# Altium project POVBase.PrjPcb
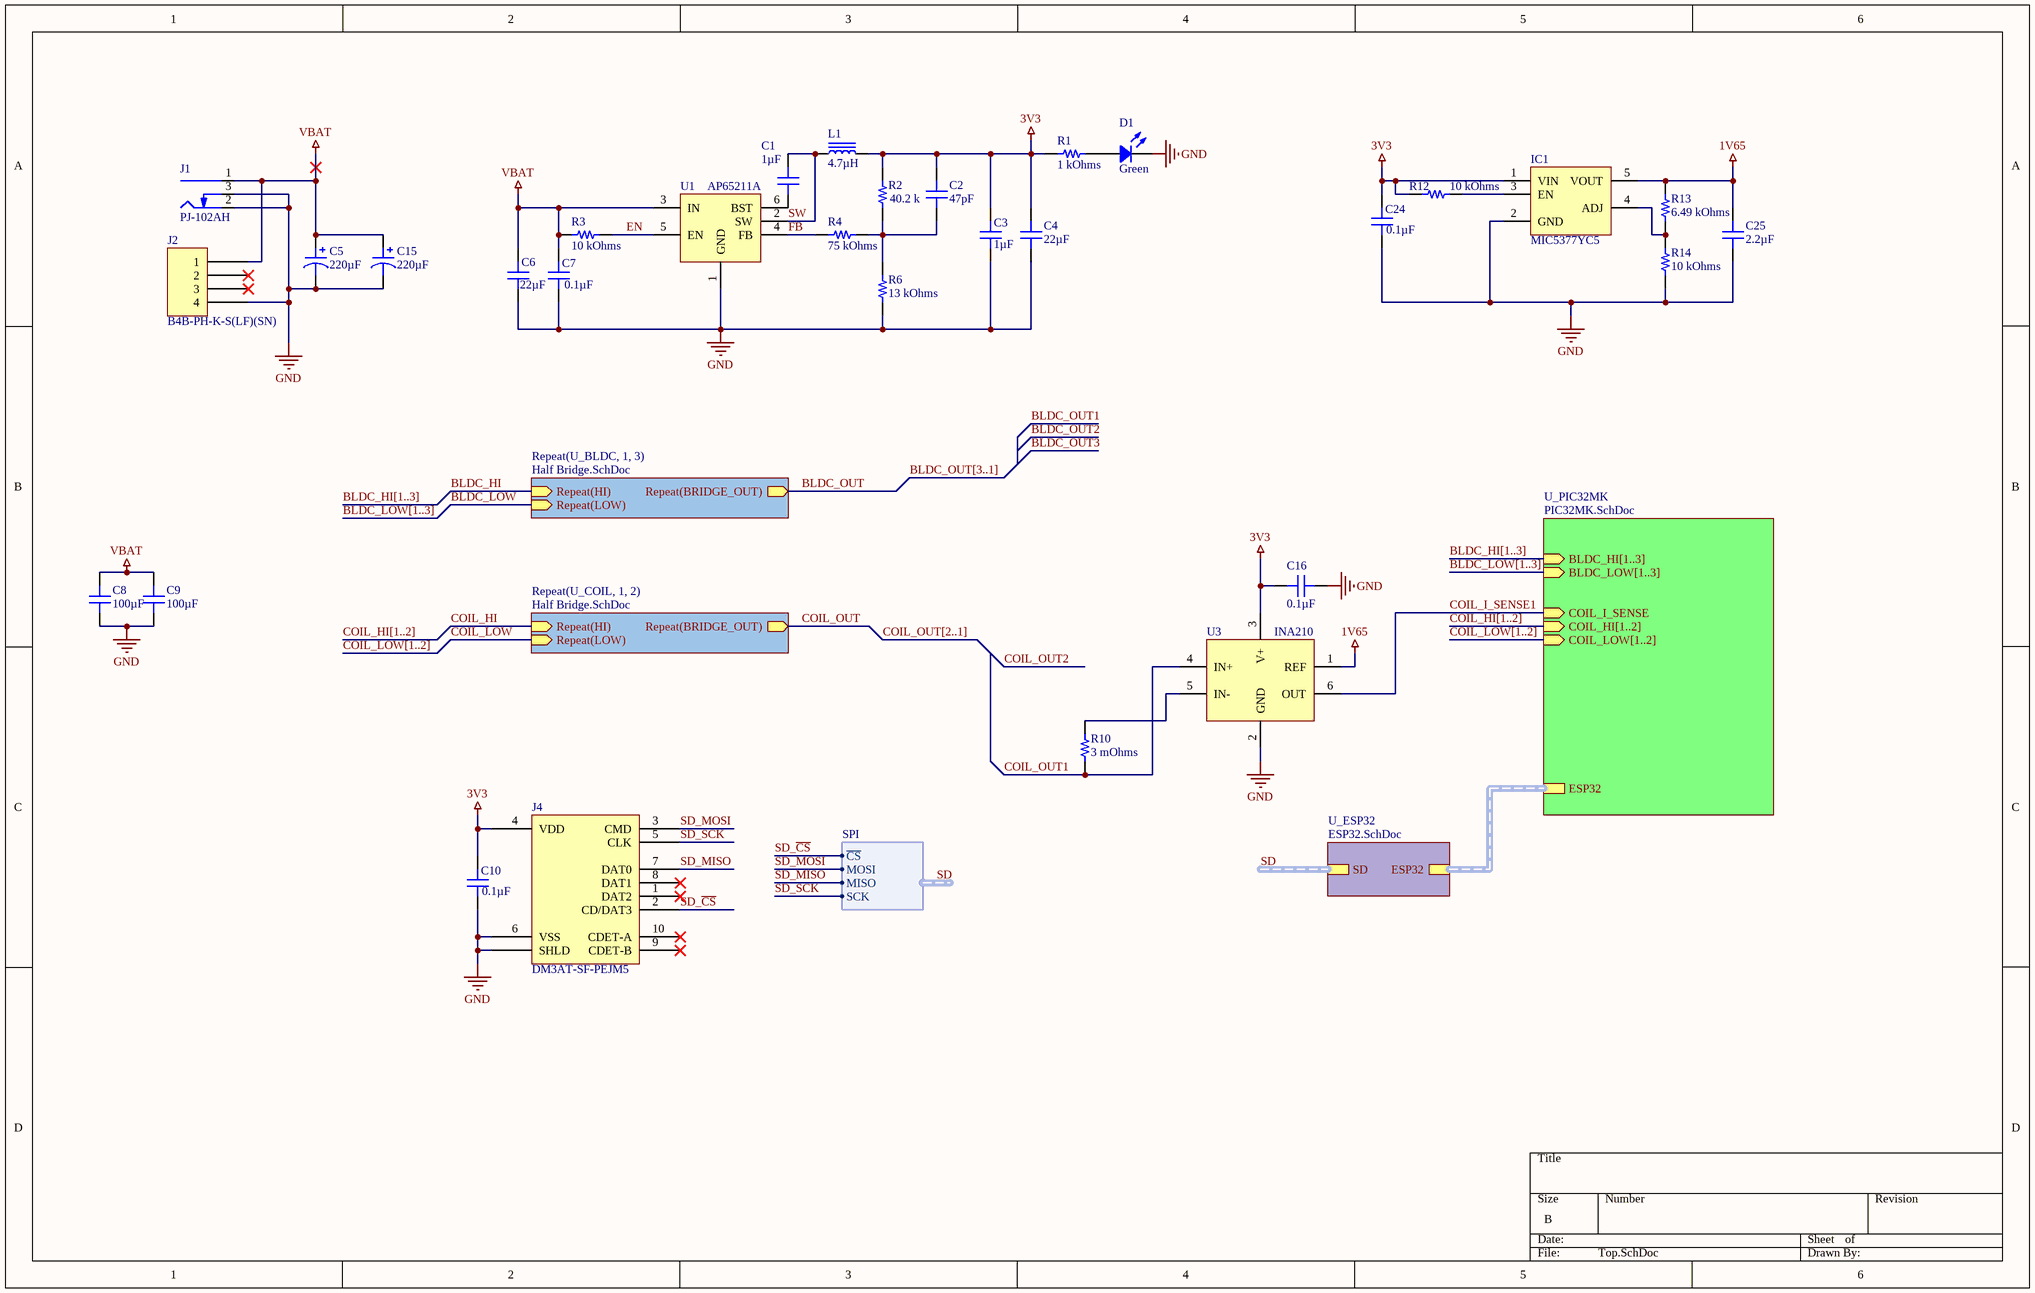
[diagram p0: Top.SchDoc]
4 sheets, 110 parts. Net scope: hierarchical (ports join the sheet entries above them; power ports are global).
Board file: POVBase.PcbDoc
Sheets:
  Top.SchDoc
    U_BLDC1 = Half Bridge.SchDoc
    U_BLDC2 = Half Bridge.SchDoc
    U_BLDC3 = Half Bridge.SchDoc
    U_PIC32MK = PIC32MK.SchDoc
    U_COIL1 = Half Bridge.SchDoc
    U_COIL2 = Half Bridge.SchDoc
    U_ESP32 = ESP32.SchDoc

## Sheet Top.SchDoc
size B

### Parts
C1  1µF  [CAP 0603_1608]
C2  47pF  [CAP 0603_1608]
C3  1µF  [CAP 0603_1608]
C4  22µF  [CAP 0805_2012]
C5  220µF  [CAP POL 2917_7343]
C6  22µF  [CAP 0805_2012]
C7  0.1µF  [CAP 0603_1608]
C8  100µF  [CAP 1210_3225 - 2.8MM]
C9  100µF  [CAP 1210_3225 - 2.8MM]
C10  0.1µF  [CAP 0603_1608]
C15  220µF  [CAP POL 2917_7343]
C16  0.1µF  [CAP 0603_1608]
C24  0.1µF  [CAP 0603_1608]
C25  2.2µF  [CAP 0603_1608]
D1  Green  [LED 0603_1608 GREEN]
IC1  MIC5377YC5  [TI SOT-23-5 DBV]
J1  PJ-102AH  [CUI PJ-102AH]
J2  B4B-PH-K-S(LF)(SN)  [JST B4B-PH-K]
J4  DM3AT-SF-PEJM5  [HIROSE DM3AT-SF-PEJM5]
L1  4.7µH  [IND 1008_2520]
R1  1 kOhms  [RES 0603_1608]
R2  40.2 k  [RES 0603_1608]
R3  10 kOhms  [RES 0603_1608]
R4  75 kOhms  [RES 0603_1608]
R6  13 kOhms  [RES 0603_1608]
R10  3 mOhms  [STACKPOLE CSR0805]
R12  10 kOhms  [RES 0603_1608]
R13  6.49 kOhms  [RES 0603_1608]
R14  10 kOhms  [RES 0603_1608]
U1  AP65211A  [TSOT-26-6]
U3  INA210  [TI SC70-6 DCK]

### Sub-sheets
Repeat(U_BLDC, 1, 3) = Half Bridge.SchDoc: Repeat(BRIDGE_OUT) (out), Repeat(HI) (in), Repeat(LOW) (in)
Repeat(U_COIL, 1, 2) = Half Bridge.SchDoc: Repeat(HI) (in), Repeat(LOW) (in), Repeat(BRIDGE_OUT) (out)
U_ESP32 = ESP32.SchDoc: ESP32 (harness ESP32), SD (harness SPI)
U_PIC32MK = PIC32MK.SchDoc: BLDC_HI[1..3] (in), BLDC_LOW[1..3] (in), COIL_I_SENSE (in), COIL_LOW[1..2] (in), COIL_HI[1..2] (in), ESP32 (harness ESP32)

### Harnesses
SPI: ~{CS}, MOSI, MISO, SCK

### Nets
1V65: C25.2 IC1.5(VOUT) R13.2 U3.1(REF)
3V3: C2.2 C3.2 C4.2 C10.1 C16.1 C24.1 IC1.1(VIN) J4.4(VDD) L1.2 R1.1 R2.2 R12.2 U3.3(V+)
GND: C3.1 C4.1 C5.2 C6.1 C7.2 C8.1 C9.1 C10.2 C15.2 C16.2 C24.2 C25.1 D1.2 IC1.2(GND) J1.2(Outer) J1.3(SW) J2.4 J4.6(VSS) J4.S(SHLD) R6.1 R14.1 U1.1(GND) U3.2(GND)
VBAT: C5.1 C6.2 C7.1 C8.2 C9.2 C15.1 J1.1(Centre) J2.1 R3.2 U1.3(IN)
BLDC_HI: sheet Repeat(U_BLDC, 1, 3)/Repeat(HI)
BLDC_LOW: sheet Repeat(U_BLDC, 1, 3)/Repeat(LOW)
BLDC_OUT: sheet Repeat(U_BLDC, 1, 3)/Repeat(BRIDGE_OUT)
COIL_HI: sheet Repeat(U_COIL, 1, 2)/Repeat(HI)
COIL_I_SENSE1: U3.6(OUT) ; sheet U_PIC32MK/COIL_I_SENSE  [project net COIL_I_SENSE]
COIL_LOW: sheet Repeat(U_COIL, 1, 2)/Repeat(LOW)
COIL_OUT: sheet Repeat(U_COIL, 1, 2)/Repeat(BRIDGE_OUT)
COIL_OUT1: R10.1 U3.4(IN+)  [project net BRIDGE_OUT]
EN: R3.1 U1.5(EN)
FB: R4.1 U1.4(FB)
SD_~{CS}: J4.2(CD/DAT3) ; sheet U_ESP32/SD.~{CS}  [project net ESP_~{CS}]
SD_MISO: J4.7(DAT0) ; sheet U_ESP32/SD.MISO  [project net ESP_SDI]
SD_MOSI: J4.3(CMD) ; sheet U_ESP32/SD.MOSI  [project net ESP_SDO]
SD_SCK: J4.5(CLK) ; sheet U_ESP32/SD.SCK  [project net ESP_SCK]
SW: C1.1 L1.1 U1.2(SW)
NetC1_2: C1.2 U1.6(BST)
NetC2_1: C2.1 R2.1 R4.2 R6.2
NetD1_1: D1.1 R1.2
NetIC1_3: IC1.3(EN) R12.1
NetIC1_4: IC1.4(ADJ) R13.1 R14.2
NetR10_2: R10.2 U3.5(IN-)

Not connected (* = marked no-connect by the designer): J2 2* 3*; J4 1(DAT2)* 8(DAT1)* 9(CDET-B)* 10(CDET-A)*

### Buses and harness runs
bus BLDC_HI[1..3]
bus BLDC_HI[1..3] = sheet U_PIC32MK/BLDC_HI[1..3]
bus BLDC_LOW[1..3]
bus BLDC_LOW[1..3] = sheet U_PIC32MK/BLDC_LOW[1..3]
bus BLDC_OUT[3..1]
bus COIL_HI[1..2]
bus COIL_HI[1..2] = sheet U_PIC32MK/COIL_HI[1..2]
bus COIL_LOW[1..2]
bus COIL_LOW[1..2] = sheet U_PIC32MK/COIL_LOW[1..2]
bus COIL_OUT[2..1]
harness SD = sheet U_ESP32/SD
harness sheet U_ESP32/ESP32 = sheet U_PIC32MK/ESP32

### Library data of the parts
C1 C3 = GCJ188R71E105KA01D: CAP CER 1UF 25V X7R 0603; Manufacturer: Murata Electronics; Tolerance: ±10%; Part Number: GCJ188R71E105KA01D; Value: 1µF; Applications: Automotive, Boardflex Sensitive; Capacitance: 1µF; ComponentLink1Description: Datasheet; ComponentLink1URL: https://search.murata.co.jp/Ceramy/image/img/A01X/G101/ENG/GCJ188R71E105KA01-01.pdf; ComponentLink2Description: DigiKey Link; ComponentLink2URL: http://digikey.com/product-detail/en/murata-electronics/GCJ188R71E105KA01D/490-14409-1-ND/6606870; Device Package: 0603 (1608 Metric); Features: Soft Termination; LastUpdated: 13-Aug-20 10:24:06 AM; Lifecycle Status: Active; Minimum Order: 1; Mounting Type: Surface Mount, MLCC; Operating Temperature: -55°C ~ 125°C; Package / Case: 0603 (1608 Metric); Packaging: TapeAndReel; PartId: 9566; Part Status: Active; Price: 0.05; Ratings: AEC-Q200; Series: GCJ; Size / Dimension: 0.063" L x 0.031" W (1.60mm x 0.80mm); Supplier 1: DigiKey; Supplier Part Number 1: 490-14409-1-ND; Temperature Coefficient: X7R; Thickness (Max): 0.035" (0.90mm)
C2 = C1608NP02A470J080AA: CAP CER 47PF 100V NP0 0603; Manufacturer: TDK Corporation; Temperature Coefficient: C0G, NP0; Tolerance: ±5%; Part Number: C1608NP02A470J080AA; Value: 47pF; Applications: General Purpose; Capacitance: 47pF; ComponentLink1Description: Datasheet; ComponentLink1URL: https://product.tdk.com/info/en/catalog/datasheets/mlcc_commercial_hightemp_en.pdf?ref_disty=digikey; ComponentLink2Description: DigiKey Link; ComponentLink2URL: http://digikey.com/product-detail/en/tdk-corporation/C1608NP02A470J080AA/445-14125-1-ND/3955791; Device Package: 0603 (1608 Metric); Features: High Temperature; LastUpdated: 13-Aug-20 10:25:18 AM; Lifecycle Status: Active; Minimum Order: 1; Mounting Type: Surface Mount, MLCC; Operating Temperature: -55°C ~ 150°C; Package / Case: 0603 (1608 Metric); Packaging: TapeAndReel; PartId: 7049; Part Status: Active; Price: 0.04; Series: C; Size / Dimension: 0.063" L x 0.031" W (1.60mm x 0.80mm); Supplier 1: DigiKey; Supplier Part Number 1: 445-14125-1-ND; Thickness (Max): 0.035" (0.90mm)
C4 = CL21A226MOQNNNE: CAP CER 22UF 16V X5R 0805; Manufacturer: Samsung Electro-Mechanics; Tolerance: ±20%; Part Number: CL21A226MOQNNNE; Value: 22µF; Applications: General Purpose; Capacitance: 22µF; ComponentLink1Description: Datasheet; ComponentLink1URL: http://www.samsungsem.com/kr/support/product-search/mlcc/CL21A226MOQNNNE.jsp; ComponentLink2Description: DigiKey Link; ComponentLink2URL: http://digikey.com/product-detail/en/samsung-electro-mechanics/CL21A226MOQNNNE/1276-2909-1-ND/3890995; Device Package: 0805 (2012 Metric); LastUpdated: 21-Jan-20 12:03:05 AM; Lifecycle Status: Active; Minimum Order: 1; Mounting Type: Surface Mount, MLCC; Operating Temperature: -55°C ~ 85°C; Package / Case: 0805 (2012 Metric); Packaging: TapeAndReel; PartId: 3052; Part Status: Active; Price: 0.11; Series: CL; Size / Dimension: 0.079" L x 0.049" W (2.00mm x 1.25mm); Supplier 1: DigiKey; Supplier Part Number 1: 1276-2909-1-ND; Temperature Coefficient: X5R; Thickness (Max): 0.055" (1.40mm); Voltage - Rated: 16V
C5 C15 = T510X227K016ATE040: CAP TANT 220UF 10% 16V 2917; Manufacturer: KEMET; Manufacturer Size Code: X; ESR (Equivalent Series Resistance): 40mOhm; Lifetime @ Temp.: 2000 Hrs @ 85°C; Type: Molded; Part Number: T510X227K016ATE040; Value: 220µF; Capacitance: 220µF; ComponentLink1Description: Datasheet; ComponentLink1URL: https://api.kemet.com/component-edge/download/datasheet/T510X227K016ATE040.pdf; ComponentLink2Description: DigiKey Link; ComponentLink2URL: http://digikey.com/product-detail/en/kemet/T510X227K016ATE040/399-4805-1-ND/1085524; Device Package: 2917 (7343 Metric); Features: General Purpose; Height - Seated (Max): 0.169" (4.30mm); LastUpdated: 30-Aug-20 8:55:47 PM; Lifecycle Status: Active; Minimum Order: 1; Mounting Type: Surface Mount; Operating Temperature: -55°C ~ 125°C; Package / Case: 2917 (7343 Metric); Packaging: TapeAndReel; PartId: 1966; Part Status: Active; Price: 4.46; Series: T510; Size / Dimension: 0.287" L x 0.169" W (7.30mm x 4.30mm); Supplier 1: DigiKey; Supplier Part Number 1: 399-4805-1-ND; Tolerance: ±10%; Voltage - Rated: 16V
C6 = C2012X7S1E106K125AC: CAP CER 10UF 25V X7S 0805; Manufacturer: TDK Corporation; Capacitance: 10µF; Tolerance: ±10%; Part Number: C2012X7S1E106K125AC; Value: 22µF; Applications: General Purpose; ComponentLink1Description: Datasheet; ComponentLink1URL: https://product.tdk.com/en/search/capacitor/ceramic/mlcc/info?part_no=C2012X7S1E106K125AC?ref_disty=digikey; ComponentLink2Description: DigiKey Link; ComponentLink2URL: http://digikey.com/product-detail/en/tdk-corporation/C2012X7S1E106K125AC/445-181600-1-ND/9991478; Device Package: 0805 (2012 Metric); Features: Low ESL; LastUpdated: 21-Jan-20 12:03:04 AM; Lifecycle Status: Active; Minimum Order: 1; Mounting Type: Surface Mount, MLCC; Operating Temperature: -55°C ~ 125°C; Package / Case: 0805 (2012 Metric); Packaging: TapeAndReel; PartId: 3339; Part Status: Active; Price: 0.15; Series: C; Size / Dimension: 0.079" L x 0.049" W (2.00mm x 1.25mm); Supplier 1: DigiKey; Supplier Part Number 1: 445-181600-1-ND; Temperature Coefficient: X7S; Thickness (Max): 0.057" (1.45mm); Voltage - Rated: 25V
C7 C10 C16 C24 = GCG188R92A104KA03D: CAP CER 0.1UF 100V 0603 EPOXY; Manufacturer: Murata Electronics; Temperature Coefficient: X8R; Tolerance: ±10%; Part Number: GCG188R92A104KA03D; Value: 0.1µF; Applications: Automotive; Capacitance: 0.1µF; ComponentLink1Description: Datasheet; ComponentLink1URL: https://search.murata.co.jp/Ceramy/image/img/A01X/G101/ENG/GCG188R92A104KA03-01.pdf; ComponentLink2Description: DigiKey Link; ComponentLink2URL: http://digikey.com/product-detail/en/murata-electronics/GCG188R92A104KA03D/490-18197-1-ND/9867926; Device Package: 0603 (1608 Metric); Features: Epoxy Mountable; LastUpdated: 21-Jan-20 12:01:59 AM; Lifecycle Status: Active; Minimum Order: 1; Mounting Type: Surface Mount, MLCC, Epoxy; Operating Temperature: -55°C ~ 150°C; Package / Case: 0603 (1608 Metric); Packaging: TapeAndReel; PartId: 9025; Part Status: Active; Price: 0.07; Ratings: AEC-Q200; Series: GCG; Size / Dimension: 0.063" L x 0.031" W (1.60mm x 0.80mm); Supplier 1: DigiKey; Supplier Part Number 1: 490-18197-1-ND; Thickness (Max): 0.035" (0.90mm); Voltage - Rated: 100V
C8 C9 = EMK325ABJ107MM-P: CAP CER 100UF 16V X5R 1210; Manufacturer: Taiyo Yuden; Tolerance: ±20%; Part Number: EMK325ABJ107MM-P; Value: 100µF; Applications: General Purpose; Capacitance: 100µF; ComponentLink1Description: Datasheet; ComponentLink1URL: https://ds.yuden.co.jp/TYCOMPAS/ut/detail?pn=EMK325ABJ107MM-P &u=M; ComponentLink2Description: DigiKey Link; ComponentLink2URL: http://digikey.com/product-detail/en/taiyo-yuden/EMK325ABJ107MM-P/587-5426-1-ND/7067102; Device Package: 1210 (3225 Metric); LastUpdated: 21-Jan-20 12:30:21 AM; Lifecycle Status: Active; Minimum Order: 1; Mounting Type: Surface Mount, MLCC; Operating Temperature: -55°C ~ 85°C; Package / Case: 1210 (3225 Metric); Packaging: TapeAndReel; PartId: 24141; Part Status: Active; Price: 0.71; Series: M; Size / Dimension: 0.126" L x 0.098" W (3.20mm x 2.50mm); Supplier 1: DigiKey; Supplier Part Number 1: 587-5426-1-ND; Temperature Coefficient: X5R; Thickness (Max): 0.110" (2.80mm); Voltage - Rated: 16V
C25 = CC0603ZRY5V5BB225: CAP CER 2.2UF 6.3V Y5V 0603; Manufacturer: Yageo; Temperature Coefficient: Y5V (F); Tolerance: -20%, +80%; Part Number: CC0603ZRY5V5BB225; Value: 2.2µF; Applications: General Purpose; Capacitance: 2.2µF; ComponentLink1Description: Datasheet; ComponentLink1URL: http://www.yageo.com/documents/recent/UPY-GPHC_Y5V_6.3V-to-50V_8.pdf; ComponentLink2Description: DigiKey Link; ComponentLink2URL: http://digikey.com/product-detail/en/yageo/CC0603ZRY5V5BB225/311-1452-1-ND/2833758; Device Package: 0603 (1608 Metric); LastUpdated: 21-Jan-20 12:02:09 AM; Lifecycle Status: Active; Minimum Order: 1; Mounting Type: Surface Mount, MLCC; Operating Temperature: -30°C ~ 85°C; Package / Case: 0603 (1608 Metric); Packaging: TapeAndReel; PartId: 2250; Part Status: Active; Price: 0.02; Series: CC; Size / Dimension: 0.063" L x 0.031" W (1.60mm x 0.80mm); Supplier 1: DigiKey; Supplier Part Number 1: 311-1452-1-ND; Thickness (Max): 0.035" (0.90mm); Voltage - Rated: 6.3V
D1 = XZCDGK53W-8VF: 1.6X0.8MM LC GREEN PIXSOLED DOME; Manufacturer: SunLED; Configuration: Independent; Current - Test: 2mA; Lens Color: Colorless; Lens Size: 0.35mm Dia; Lens Style: Round with Domed Top; Lens Transparency: Clear; Millicandela Rating: 417mcd; Viewing Angle: 60°; Voltage - Forward (Vf) (Typ): 2.65V; Wavelength - Dominant: 525nm; Wavelength - Peak: 515nm; Part Number: XZCDGK53W-8VF; Color: Green; ComponentLink1Description: Datasheet; ComponentLink1URL: https://www.sunledusa.com/products/spec/XZCDGK53W-8VF.pdf; ComponentLink2Description: DigiKey Link; ComponentLink2URL: http://digikey.com/product-detail/en/sunled/XZCDGK53W-8VF/1497-XZCDGK53W-8VFCT-ND/10449792; Device Package: 0603 (1608 Metric); Height (Max): 1.10mm; LastUpdated: 21-Jan-20 3:12:09 AM; Lifecycle Status: Active; Minimum Order: 1; Mounting Type: Surface Mount; Package / Case: 0603 (1608 Metric); Packaging: Unknown; PartId: 938; Part Status: Active; Price: 0.18; Series: Ultra Low Current; Size / Dimension: 1.60mm L x 0.80mm W; Supplier 1: DigiKey; Supplier Part Number 1: 1497-XZCDGK53W-8VFCT-ND; Supplier Device Package: 2-SMD; Value: Green
IC1 = MIC5377YC5: IC REG LIN POS ADJ 150MA SOT23-5; Manufacturer: Texas Instruments; Control Features: Enable; Current - Quiescent (Iq): 100µA; Current - Supply (Max): 140µA; Number of Regulators: 1; Output Configuration: Positive; Output Type: Adjustable; Protection Features: Over Current, Over Temperature, Reverse Polarity; PSRR: 60dB (1kHz); Voltage - Input (Max): 10V; Voltage - Output (Max): 6.5V; Voltage - Output (Min/Fixed): 1.5V; Part Number: MIC5377YC5; ComponentLink1Description: Datasheet; ComponentLink1URL: http://www.ti.com/general/docs/suppproductinfo.tsp?distId=10&gotoUrl=http%3A%2F%2Fwww.ti.com%2Flit%2Fgpn%2Ftps763; ComponentLink2Description: DigiKey Link; ComponentLink2URL: http://digikey.com/product-detail/en/texas-instruments/TPS76301DBVR/296-11014-1-ND/477331; Current - Output: 150mA; Device Package: SC-74A, SOT-753; LastUpdated: 18-Jan-20 8:02:45 PM; Lifecycle Status: Active; Minimum Order: 1; Mounting Type: Surface Mount; Operating Temperature: -40°C ~ 125°C; Package / Case: SC-74A, SOT-753; Packaging: TapeAndReel; Part Status: Active; Price: 0.33; Series: -; Supplier 1: DigiKey; Supplier Part Number 1: 296-11014-1-ND; Supplier Device Package: SOT-23-5
J1 = PJ-102AH: CONN PWR JACK 2X5.5MM SOLDER; Manufacturer: CUI Devices; Actual Diameter: 0.079" (2.00mm ID), 0.256" (6.50mm OD); Current Rating (Amps): 5A; Gender: Male; Industry Recognized Mating Diameter: 2.00mm ID (0.079"), 5.50mm OD (0.217"); Internal Switch(s): Single Switch, Normally Closed; Material Flammability Rating: UL94 V-0; Mating Length/Depth: 0.354" (9.00mm); Number of Positions/Contacts: 2 Conductors, 3 Contacts; Shielding: Unshielded; Voltage - Rated: 24VDC; Part Number: PJ-102AH; ComponentLink1Description: Datasheet; ComponentLink1URL: https://www.cuidevices.com/product/resource/digikeypdf/pj-102ah.pdf; ComponentLink2Description: DigiKey Link; ComponentLink2URL: //digikey.com/product-detail/en/cui-devices/PJ-102AH/CP-102AH-ND/408448; Connector Type: Jack; LastUpdated: 12/16/2019 7:01:27 PM; Lifecycle Status: 0; Minimum Order: 1; Mounting Type: Through Hole, Right Angle; Packaging: Tray; Part Status: Active; Price: 0.76; Series: -; Supplier 1: DigiKey; Supplier Part Number 1: CP-102AH-ND; Termination: Solder
J2 = B4B-PH-K-S(LF)(SN): CONN HEADER VERT 4POS 2MM; Manufacturer: JST Sales America Inc.; Contact Length - Mating: 0.130" (3.30mm); Contact Length - Post: 0.134" (3.40mm); Current Rating (Amps): 2A; Material Flammability Rating: UL94 V-0; Number of Positions: 4; Number of Positions Loaded: All; Overall Contact Length: 0.333" (8.45mm); Pitch - Mating: 0.079" (2.00mm); Shrouding: Shrouded - 4 Wall; Style: Board to Cable/Wire; Voltage Rating: 100V; Part Number: B4B-PH-K-S(LF)(SN); ComponentLink1Description: Datasheet; ComponentLink1URL: http://www.jst-mfg.com/product/pdf/eng/ePH.pdf; ComponentLink2Description: DigiKey Link; ComponentLink2URL: http://digikey.com/product-detail/en/jst-sales-america-inc/B4B-PH-K-S-LF-SN/455-1706-ND/926613; Connector Type: Header; Contact Finish - Mating: Tin; Contact Finish - Post: Tin; Contact Material: Brass; Contact Shape: Square; Contact Type: Male Pin; Fastening Type: Detent Lock; Insulation Color: Natural; Insulation Height: 0.236" (6.00mm); Insulation Material: Polyamide (PA66), Nylon 6/6; LastUpdated: 1/12/2020 10:29:40 PM; Lifecycle Status: Active; Minimum Order: 1; Mounting Type: Through Hole; Number of Rows: 1; Operating Temperature: -25°C ~ 85°C; Packaging: Bulk; PartId: 27; Part Status: Active; Price: 0.24; Series: PH; Supplier 1: DigiKey; Supplier Part Number 1: 455-1706-ND; Termination: Press-Fit, Solder
J4 = DM3AT-SF-PEJM5: CONN MICRO SD CARD PUSH-PUSH R/A; Manufacturer: Hirose Electric Co Ltd; Card Type: Secure Digital - microSD™; Connector Type: Connector and Ejector; Insertion, Removal Method: Push In, Push Out; Number of Positions: 10 (8 + 2); Part Number: DM3AT-SF-PEJM5; ComponentLink1Description: Datasheet; ComponentLink1URL: https://www.hirose.com/product/document?clcode=CL0609-0033-6-00&productname=DM3AT-SF-PEJ2M5&series=DM3&documenttype=Catalog&lang=en&documentid=D49662_en; ComponentLink2Description: DigiKey Link; ComponentLink2URL: //digikey.com/product-detail/en/hirose-electric-co-ltd/DM3AT-SF-PEJM5/HR1964TR-ND/2533565; Contact Finish: Gold; Features: Switch; Height Above Board: 0.066" (1.68mm); LastUpdated: 12/16/2019 8:34:40 PM; Lifecycle Status: 0; Minimum Order: 1; Mounting Feature: Normal, Standard - Top; Mounting Type: Surface Mount, Right Angle; Packaging: TapeAndReel; Part Status: Active; Price: 1.41; Series: DM3; Supplier 1: DigiKey; Supplier Part Number 1: HR1964TR-ND
L1 = MLP2520S4R7ST0S1: FIXED IND 4.7UH 1A 110 MOHM SMD; Manufacturer: TDK Corporation; DC Resistance (DCR): 143mOhm Max; Inductance Frequency - Test: 2MHz; Material - Core: Ferrite; Shielding: Shielded; Tolerance: ±20%; Type: Multilayer; Part Number: MLP2520S4R7ST0S1; ComponentLink1Description: Datasheet; ComponentLink1URL: https://product.tdk.com/info/en/catalog/datasheets/inductor_commercial_power_mlp2520_en.pdf?ref_disty=digikey; ComponentLink2Description: DigiKey Link; ComponentLink2URL: http://digikey.com/product-detail/en/tdk-corporation/MLP2520S4R7ST0S1/445-6378-1-ND/2465705; Current Rating (Amps): 1A; Device Package: 1008 (2520 Metric); Height - Seated (Max): 0.039" (1.00mm); Inductance: 4.7µH; LastUpdated: 13-Aug-20 11:03:40 AM; Lifecycle Status: Active; Minimum Order: 1; Mounting Type: Surface Mount; Operating Temperature: -40°C ~ 125°C; Package / Case: 1008 (2520 Metric); Packaging: TapeAndReel; PartId: 3467; Part Status: Active; Price: 0.14; Series: MLP; Size / Dimension: 0.098" L x 0.079" W (2.50mm x 2.00mm); Supplier 1: DigiKey; Supplier Part Number 1: 445-6378-1-ND; Supplier Device Package: 1008 (2520 Metric); Value: 4.7µH
R1 = RNCF0603DTE1K00: RES 1K OHM 0.5% 1/10W 0603; Manufacturer: Stackpole Electronics Inc; Power (Watts): 0.1W, 1/10W; Temperature Coefficient: ±25ppm/°C; Part Number: RNCF0603DTE1K00; Value: 1 kOhms; ComponentLink1Description: Datasheet; ComponentLink1URL: https://www.seielect.com/catalog/sei-rncf.pdf; ComponentLink2Description: DigiKey Link; ComponentLink2URL: http://digikey.com/product-detail/en/stackpole-electronics-inc/RNCF0603DTE1K00/RNCF0603DTE1K00CT-ND/9915086; Composition: Thin Film; Device Package: 0603 (1608 Metric); Features: Automotive AEC-Q200; Height - Seated (Max): 0.022" (0.55mm); LastUpdated: 21-Jan-20 12:14:28 AM; Lifecycle Status: Active; Minimum Order: 1; Number of Terminations: 2; Operating Temperature: -55°C ~ 155°C; Package / Case: 0603 (1608 Metric); Packaging: TapeAndReel; PartId: 26300; Part Status: Active; Price: 0.05; Ratings: AEC-Q200; Resistance: 1 kOhms; Series: RNCF; Size / Dimension: 0.061" L x 0.031" W (1.55mm x 0.80mm); Supplier 1: DigiKey; Supplier Part Number 1: RNCF0603DTE1K00CT-ND; Supplier Device Package: 0603; Tolerance: ±0.5%
R2 = RT0603DRD0740K2L: RES SMD 40.2KOHM 0.5% 1/10W 0603; Manufacturer: Yageo; Power (Watts): 0.1W, 1/10W; Resistance: 40.2 kOhms; Temperature Coefficient: ±25ppm/°C; Part Number: RT0603DRD0740K2L; Value: 40.2 k; ComponentLink1Description: Datasheet; ComponentLink1URL: https://www.yageo.com/upload/media/product/productsearch/datasheet/rchip/PYu-RT_1-to-0.01_RoHS_L_11.pdf; ComponentLink2Description: DigiKey Link; ComponentLink2URL: http://digikey.com/product-detail/en/yageo/RT0603DRD0740K2L/311-40.2KDCT-ND/1035817; Composition: Thin Film; Device Package: 0603 (1608 Metric); Height - Seated (Max): 0.022" (0.55mm); LastUpdated: 13-Aug-20 10:36:48 AM; Lifecycle Status: Active; Minimum Order: 1; Number of Terminations: 2; Operating Temperature: -55°C ~ 155°C; Package / Case: 0603 (1608 Metric); Packaging: TapeAndReel; PartId: 18076; Part Status: Active; Price: 0.02; Series: RT; Size / Dimension: 0.063" L x 0.031" W (1.60mm x 0.80mm); Supplier 1: DigiKey; Supplier Part Number 1: 311-40.2KDCT-ND; Supplier Device Package: 0603; Tolerance: ±0.5%
R3 R12 R14 = RNCS0603BKE10K0: RES 10K OHM 0.1% 1/16W 0603; Manufacturer: Stackpole Electronics Inc; Power (Watts): 0.063W, 1/16W; Temperature Coefficient: ±25ppm/°C; Part Number: RNCS0603BKE10K0; Value: 10 kOhms; ComponentLink1Description: Datasheet; ComponentLink1URL: https://www.seielect.com/catalog/sei-rncs_rnch.pdf; ComponentLink2Description: DigiKey Link; ComponentLink2URL: http://digikey.com/product-detail/en/stackpole-electronics-inc/RNCS0603BKE10K0/RNCS0603BKE10K0CT-ND/1800113; Composition: Thin Film; Device Package: 0603 (1608 Metric); Features: Anti-Corrosive, Automotive AEC-Q200, Moisture Resistant; Height - Seated (Max): 0.022" (0.55mm); LastUpdated: 21-Jan-20 12:25:01 AM; Lifecycle Status: Active; Minimum Order: 1; Number of Terminations: 2; Operating Temperature: -55°C ~ 155°C; Package / Case: 0603 (1608 Metric); Packaging: TapeAndReel; PartId: 4838; Part Status: Active; Price: 0.08; Ratings: AEC-Q200; Resistance: 10 kOhms; Series: RNCS; Size / Dimension: 0.061" L x 0.031" W (1.55mm x 0.80mm); Supplier 1: DigiKey; Supplier Part Number 1: RNCS0603BKE10K0CT-ND; Supplier Device Package: 0603; Tolerance: ±0.1%
R4 = CR0603-JW-753ELF: RES SMD 75K OHM 5% 1/10W 0603; Manufacturer: Bourns Inc.; Power (Watts): 0.1W, 1/10W; Temperature Coefficient: ±200ppm/°C; Part Number: CR0603-JW-753ELF; Value: 75 kOhms; ComponentLink1Description: Datasheet; ComponentLink1URL: https://www.bourns.com/docs/Product-Datasheets/CHPREZTR.pdf; ComponentLink2Description: DigiKey Link; ComponentLink2URL: http://digikey.com/product-detail/en/bourns-inc/CR0603-JW-753ELF/CR0603-JW-753ELFCT-ND/4247893; Composition: Thick Film; Device Package: 0603 (1608 Metric); Features: Moisture Resistant; Height - Seated (Max): 0.022" (0.55mm); LastUpdated: 13-Aug-20 10:36:37 AM; Lifecycle Status: Active; Minimum Order: 1; Number of Terminations: 2; Operating Temperature: -55°C ~ 155°C; Package / Case: 0603 (1608 Metric); Packaging: CutTape; PartId: 23428; Part Status: Active; Price: 0.10; Resistance: 75 kOhms; Series: CR0603; Size / Dimension: 0.063" L x 0.031" W (1.60mm x 0.80mm); Supplier 1: DigiKey; Supplier Part Number 1: CR0603-JW-753ELFCT-ND; Supplier Device Package: 0603; Tolerance: ±5%
R6 = RG1608P-133-B-T5: RES SMD 13K OHM 0.1% 1/10W 0603; Manufacturer: Susumu; Power (Watts): 0.1W, 1/10W; Temperature Coefficient: ±25ppm/°C; Part Number: RG1608P-133-B-T5; Value: 13 kOhms; ComponentLink1Description: Datasheet; ComponentLink1URL: //media.digikey.com/pdf/Data%20Sheets/Susumu%20PDFs/RG_RM_RGH_Oct2012.pdf; ComponentLink2Description: DigiKey Link; ComponentLink2URL: http://digikey.com/product-detail/en/susumu/RG1608P-133-B-T5/RG16P13.0KBCT-ND/1240863; Composition: Thin Film; Device Package: 0603 (1608 Metric); Features: Anti-Sulfur, Automotive AEC-Q200; Height - Seated (Max): 0.020" (0.50mm); LastUpdated: 13-Aug-20 10:37:00 AM; Lifecycle Status: Active; Minimum Order: 1; Number of Terminations: 2; Operating Temperature: -55°C ~ 155°C; Package / Case: 0603 (1608 Metric); Packaging: TapeAndReel; PartId: 12110; Part Status: Active; Price: 0.06; Ratings: AEC-Q200; Resistance: 13 kOhms; Series: RG; Size / Dimension: 0.063" L x 0.031" W (1.60mm x 0.80mm); Supplier 1: DigiKey; Supplier Part Number 1: RG16P13.0KBCT-ND; Supplier Device Package: 0603; Tolerance: ±0.1%
R10 = LVT06R0030GER: RES 0.003 OHM 2% 1/3W 0603; Manufacturer: Ohmite; Power (Watts): 0.333W, 1/3W; Temperature Coefficient: ±150ppm/°C; Part Number: LVT06R0030GER; Package / Case: 0603 (1608 Metric); ComponentLink1Description: Datasheet; ComponentLink1URL: https://www.ohmite.com/assets/docs/res_lvt.pdf?r=false; ComponentLink2Description: DigiKey Link; ComponentLink2URL: http://digikey.com/product-detail/en/ohmite/LVT06R0030GER/LVT06R0030GERCT-ND/9556168; Composition: Metal Element; Device Package: 0603 (1608 Metric); Features: Current Sense; Height - Seated (Max): 0.026" (0.65mm); LastUpdated: 9/2/2020 1:17:40 AM; Lifecycle Status: Active; Minimum Order: 1; Number of Terminations: 2; Operating Temperature: -55°C ~ 155°C; Packaging: TapeAndReel; PartId: 540; Part Status: Active; Price: 0.13; Resistance: 3 mOhms; Series: LVT; Size / Dimension: 0.063" L x 0.031" W (1.60mm x 0.80mm); Supplier 1: DigiKey; Supplier Part Number 1: LVT06R0030GERCT-ND; Supplier Device Package: 0603; Tolerance: ±2%; Value: 3 mOhms
R13 = RC0603FR-076K49L: RES SMD 6.49K OHM 1% 1/10W 0603; Manufacturer: Yageo; Power (Watts): 0.1W, 1/10W; Temperature Coefficient: ±100ppm/°C; Part Number: RC0603FR-076K49L; Value: 6.49 kOhms; ComponentLink1Description: Datasheet; ComponentLink1URL: https://www.yageo.com/upload/media/product/productsearch/datasheet/rchip/PYu-RC_Group_51_RoHS_L_10.pdf; ComponentLink2Description: DigiKey Link; ComponentLink2URL: http://digikey.com/product-detail/en/yageo/RC0603FR-076K49L/311-6.49KHRCT-ND/730268; Composition: Thick Film; Device Package: 0603 (1608 Metric); Features: Moisture Resistant; Height - Seated (Max): 0.022" (0.55mm); LastUpdated: 21-Jan-20 12:22:01 AM; Lifecycle Status: Active; Minimum Order: 1; Number of Terminations: 2; Operating Temperature: -55°C ~ 155°C; Package / Case: 0603 (1608 Metric); Packaging: CutTape; PartId: 12285; Part Status: Active; Price: 0.10; Resistance: 6.49 kOhms; Series: RC; Size / Dimension: 0.063" L x 0.031" W (1.60mm x 0.80mm); Supplier 1: DigiKey; Supplier Part Number 1: 311-6.49KHRCT-ND; Supplier Device Package: 0603; Tolerance: ±1%
U1 = AP65211A: ADJ step down Buck
U3 = INA210: Current sense amplifier

## Sheet Half Bridge.SchDoc
size A
Used 5 times, as channels U_BLDC1, U_BLDC2, U_BLDC3, U_COIL1, U_COIL2. Parts and nets are listed once, with the designators drawn on the sheet.
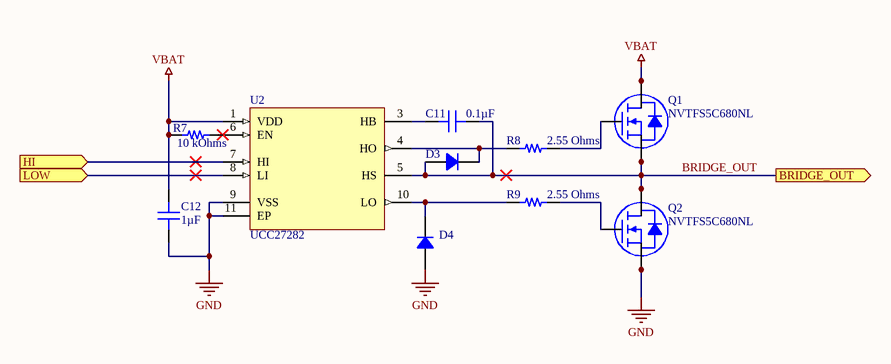
[diagram p1: Half Bridge.SchDoc]

### Parts
C11  0.1µF  [CAP 0603_1608]
C12  1µF  [CAP 0603_1608]
D3  V1F6-M3/H  [SMF DO-219AB]  (value not drawn)
D4  V1F6-M3/H  [SMF DO-219AB]  (value not drawn)
Q1  NVTFS5C680NL  [NVTFS015N04CTAG]
Q2  NVTFS5C680NL  [NVTFS015N04CTAG]
R7  10 kOhms  [RES 0603_1608]
R8  2.55 Ohms  [RES 0603_1608]
R9  2.55 Ohms  [RES 0603_1608]
U2  UCC27282  [VSON-10]

### Ports
BRIDGE_OUT (out), HI (in), LOW (in)

### Nets
GND: C12.1 D4.1 Q2.1(S) Q2.2(S) Q2.3(S) U2.9(VSS) U2.11(EP)
VBAT: C12.2 Q1.5(D) Q1.6(D) Q1.7(D) Q1.8(D) R7.1 U2.1(VDD)
BRIDGE_OUT: C11.1 D3.1 Q1.1(S) Q1.2(S) Q1.3(S) Q2.5(D) Q2.6(D) Q2.7(D) Q2.8(D) U2.5(HS) ; port BRIDGE_OUT
HI: U2.7(HI) ; port HI
LOW: U2.8(LI) ; port LOW
NetC11_2: C11.2 U2.3(HB)
NetD3_2: D3.2 R8.1 U2.4(HO)
NetD4_2: D4.2 R9.1 U2.10(LO)
NetQ1_4: Q1.4(G) R8.2
NetQ2_4: Q2.4(G) R9.2
NetR7_2: R7.2 U2.6(EN)

### Channels
U_BLDC1: designators end in _1; ports BRIDGE_OUT=BLDC_OUT1 HI=BLDC_HI1 LOW=BLDC_LOW1
U_BLDC2: designators end in _2; ports BRIDGE_OUT=BLDC_OUT2 HI=BLDC_HI2 LOW=BLDC_LOW2
U_BLDC3: designators end in _3; ports BRIDGE_OUT=BLDC_OUT3 HI=BLDC_HI3 LOW=BLDC_LOW3
U_COIL1: designators end in _4; ports BRIDGE_OUT=BRIDGE_OUT HI=COIL_HI1 LOW=COIL_LOW1
U_COIL2: designators end in _5; ports BRIDGE_OUT=BRIDGE_OUT_U_COIL2 HI=COIL_HI2 LOW=COIL_LOW2

### Library data of the parts
C11 = GCG188R92A104KA03D: as C7 on sheet Top; Part Number: GCG188R92A104KA03D; Value: 0.1µF; Applications: Automotive; Capacitance: 0.1µF; ComponentLink1Description: Datasheet; ComponentLink1URL: https://search.murata.co.jp/Ceramy/image/img/A01X/G101/ENG/GCG188R92A104KA03-01.pdf; ComponentLink2Description: DigiKey Link; ComponentLink2URL: http://digikey.com/product-detail/en/murata-electronics/GCG188R92A104KA03D/490-18197-1-ND/9867926; Device Package: 0603 (1608 Metric); Features: Epoxy Mountable; LastUpdated: 21-Jan-20 12:01:59 AM; Lifecycle Status: Active; Minimum Order: 1; Mounting Type: Surface Mount, MLCC, Epoxy; Operating Temperature: -55°C ~ 150°C; Package / Case: 0603 (1608 Metric); Packaging: TapeAndReel; PartId: 9025; Part Status: Active; Price: 0.07; Ratings: AEC-Q200; Series: GCG; Size / Dimension: 0.063" L x 0.031" W (1.60mm x 0.80mm); Supplier 1: DigiKey; Supplier Part Number 1: 490-18197-1-ND; Thickness (Max): 0.035" (0.90mm); Voltage - Rated: 100V
C12 = GCJ188R71E105KA01D: as C1 on sheet Top; Part Number: GCJ188R71E105KA01D; Value: 1µF; Applications: Automotive, Boardflex Sensitive; Capacitance: 1µF; ComponentLink1Description: Datasheet; ComponentLink1URL: https://search.murata.co.jp/Ceramy/image/img/A01X/G101/ENG/GCJ188R71E105KA01-01.pdf; ComponentLink2Description: DigiKey Link; ComponentLink2URL: http://digikey.com/product-detail/en/murata-electronics/GCJ188R71E105KA01D/490-14409-1-ND/6606870; Device Package: 0603 (1608 Metric); Features: Soft Termination; LastUpdated: 21-Jan-20 12:01:58 AM; Lifecycle Status: Active; Minimum Order: 1; Mounting Type: Surface Mount, MLCC; Operating Temperature: -55°C ~ 125°C; Package / Case: 0603 (1608 Metric); Packaging: TapeAndReel; PartId: 9566; Part Status: Active; Price: 0.05; Ratings: AEC-Q200; Series: GCJ; Size / Dimension: 0.063" L x 0.031" W (1.60mm x 0.80mm); Supplier 1: DigiKey; Supplier Part Number 1: 490-14409-1-ND; Temperature Coefficient: X7R; Thickness (Max): 0.035" (0.90mm); Voltage - Rated: 25V
D3 D4 = V1F6-M3/H: 1A 60V SMF TRENCH SKY RECT; Manufacturer: Vishay Semiconductor Diodes Division; Capacitance @ Vr, F: 135pF @ 4V, 1MHz; Current - Reverse Leakage @ Vr: 270µA @ 60V; Diode Type: Schottky; Speed: Fast Recovery =< 500ns, > 200mA (Io); Voltage - Forward (Vf) (Max) @ If: 600mV @ 1A; Part Number: V1F6-M3/H; ComponentLink1Description: Datasheet; ComponentLink1URL: http://www.vishay.com/docs/87555/v1f6.pdf; ComponentLink2Description: DigiKey Link; ComponentLink2URL: http://digikey.com/product-detail/en/vishay-semiconductor-diodes-division/V1F6-M3-H/112-V1F6-M3-HCT-ND/10660586; Current - Average Rectified (Io): 1A; LastUpdated: 02-Sep-20 1:23:13 AM; Lifecycle Status: Active; Minimum Order: 1; Mounting Type: Surface Mount; Operating Temperature - Junction: -40°C ~ 150°C; Package / Case: DO-219AB; Packaging: Unknown; PartId: 3272; Part Status: Active; Price: 0.07; Series: eSMP®, TMBS®; Supplier 1: DigiKey; Supplier Part Number 1: 112-V1F6-M3/HCT-ND; Supplier Device Package: DO-219AB (SMF); Voltage - DC Reverse (Vr) (Max): 60V
Q1 Q2 = NVTFS5C680NL: N-FET
R7 = RNCS0603BKE10K0: as R3 on sheet Top; Part Number: RNCS0603BKE10K0; Value: 10 kOhms; ComponentLink1Description: Datasheet; ComponentLink1URL: https://www.seielect.com/catalog/sei-rncs_rnch.pdf; ComponentLink2Description: DigiKey Link; ComponentLink2URL: http://digikey.com/product-detail/en/stackpole-electronics-inc/RNCS0603BKE10K0/RNCS0603BKE10K0CT-ND/1800113; Composition: Thin Film; Device Package: 0603 (1608 Metric); Features: Anti-Corrosive, Automotive AEC-Q200, Moisture Resistant; Height - Seated (Max): 0.022" (0.55mm); LastUpdated: 21-Jan-20 12:25:01 AM; Lifecycle Status: Active; Minimum Order: 1; Number of Terminations: 2; Operating Temperature: -55°C ~ 155°C; Package / Case: 0603 (1608 Metric); Packaging: TapeAndReel; PartId: 4838; Part Status: Active; Price: 0.08; Ratings: AEC-Q200; Resistance: 10 kOhms; Series: RNCS; Size / Dimension: 0.061" L x 0.031" W (1.55mm x 0.80mm); Supplier 1: DigiKey; Supplier Part Number 1: RNCS0603BKE10K0CT-ND; Supplier Device Package: 0603; Tolerance: ±0.1%
R8 R9 = CRCW06032R55FKEA: RES SMD 2.55 OHM 1% 1/10W 0603; Manufacturer: Vishay Dale; Power (Watts): 0.1W, 1/10W; Temperature Coefficient: ±100ppm/°C; Part Number: CRCW06032R55FKEA; Value: 2.55 Ohms; ComponentLink1Description: Datasheet; ComponentLink1URL: http://www.vishay.com/docs/20035/dcrcwe3.pdf; ComponentLink2Description: DigiKey Link; ComponentLink2URL: http://digikey.com/product-detail/en/vishay-dale/CRCW06032R55FKEA/541-2.55HHCT-ND/1962041; Composition: Thick Film; Device Package: 0603 (1608 Metric); Features: Automotive AEC-Q200; Height - Seated (Max): 0.020" (0.50mm); LastUpdated: 21-Jan-20 12:16:55 AM; Lifecycle Status: Active; Minimum Order: 1; Number of Terminations: 2; Operating Temperature: -55°C ~ 155°C; Package / Case: 0603 (1608 Metric); Packaging: CutTape; PartId: 23466; Part Status: Active; Price: 0.10; Ratings: AEC-Q200; Resistance: 2.55 Ohms; Series: CRCW; Size / Dimension: 0.061" L x 0.033" W (1.55mm x 0.85mm); Supplier 1: DigiKey; Supplier Part Number 1: 541-2.55HHCT-ND; Supplier Device Package: 0603; Tolerance: ±1%
U2 = UCC27282DRCR: 3-A, 120-V half bridge gate driver with 5-V UVLO, interlock and enable 10-VSON -40 to 125; MF: Texas Instruments; Texas_Instruments-Purchase-URL: https://snapeda.com/shop?store=Texas+Instruments&id=3625400; Price: None; Availability: Warning; Package: VSON-10 Texas Instruments; SnapEDA_Link: https://www.snapeda.com/parts/UCC27282DRCR/Texas%20Instruments/view-part/3625400/?ref=snap; DigiKey-Purchase-URL: https://snapeda.com/shop?store=DigiKey&id=3625400; MP: UCC27282DRCR; Value: *

## Sheet PIC32MK.SchDoc
size B
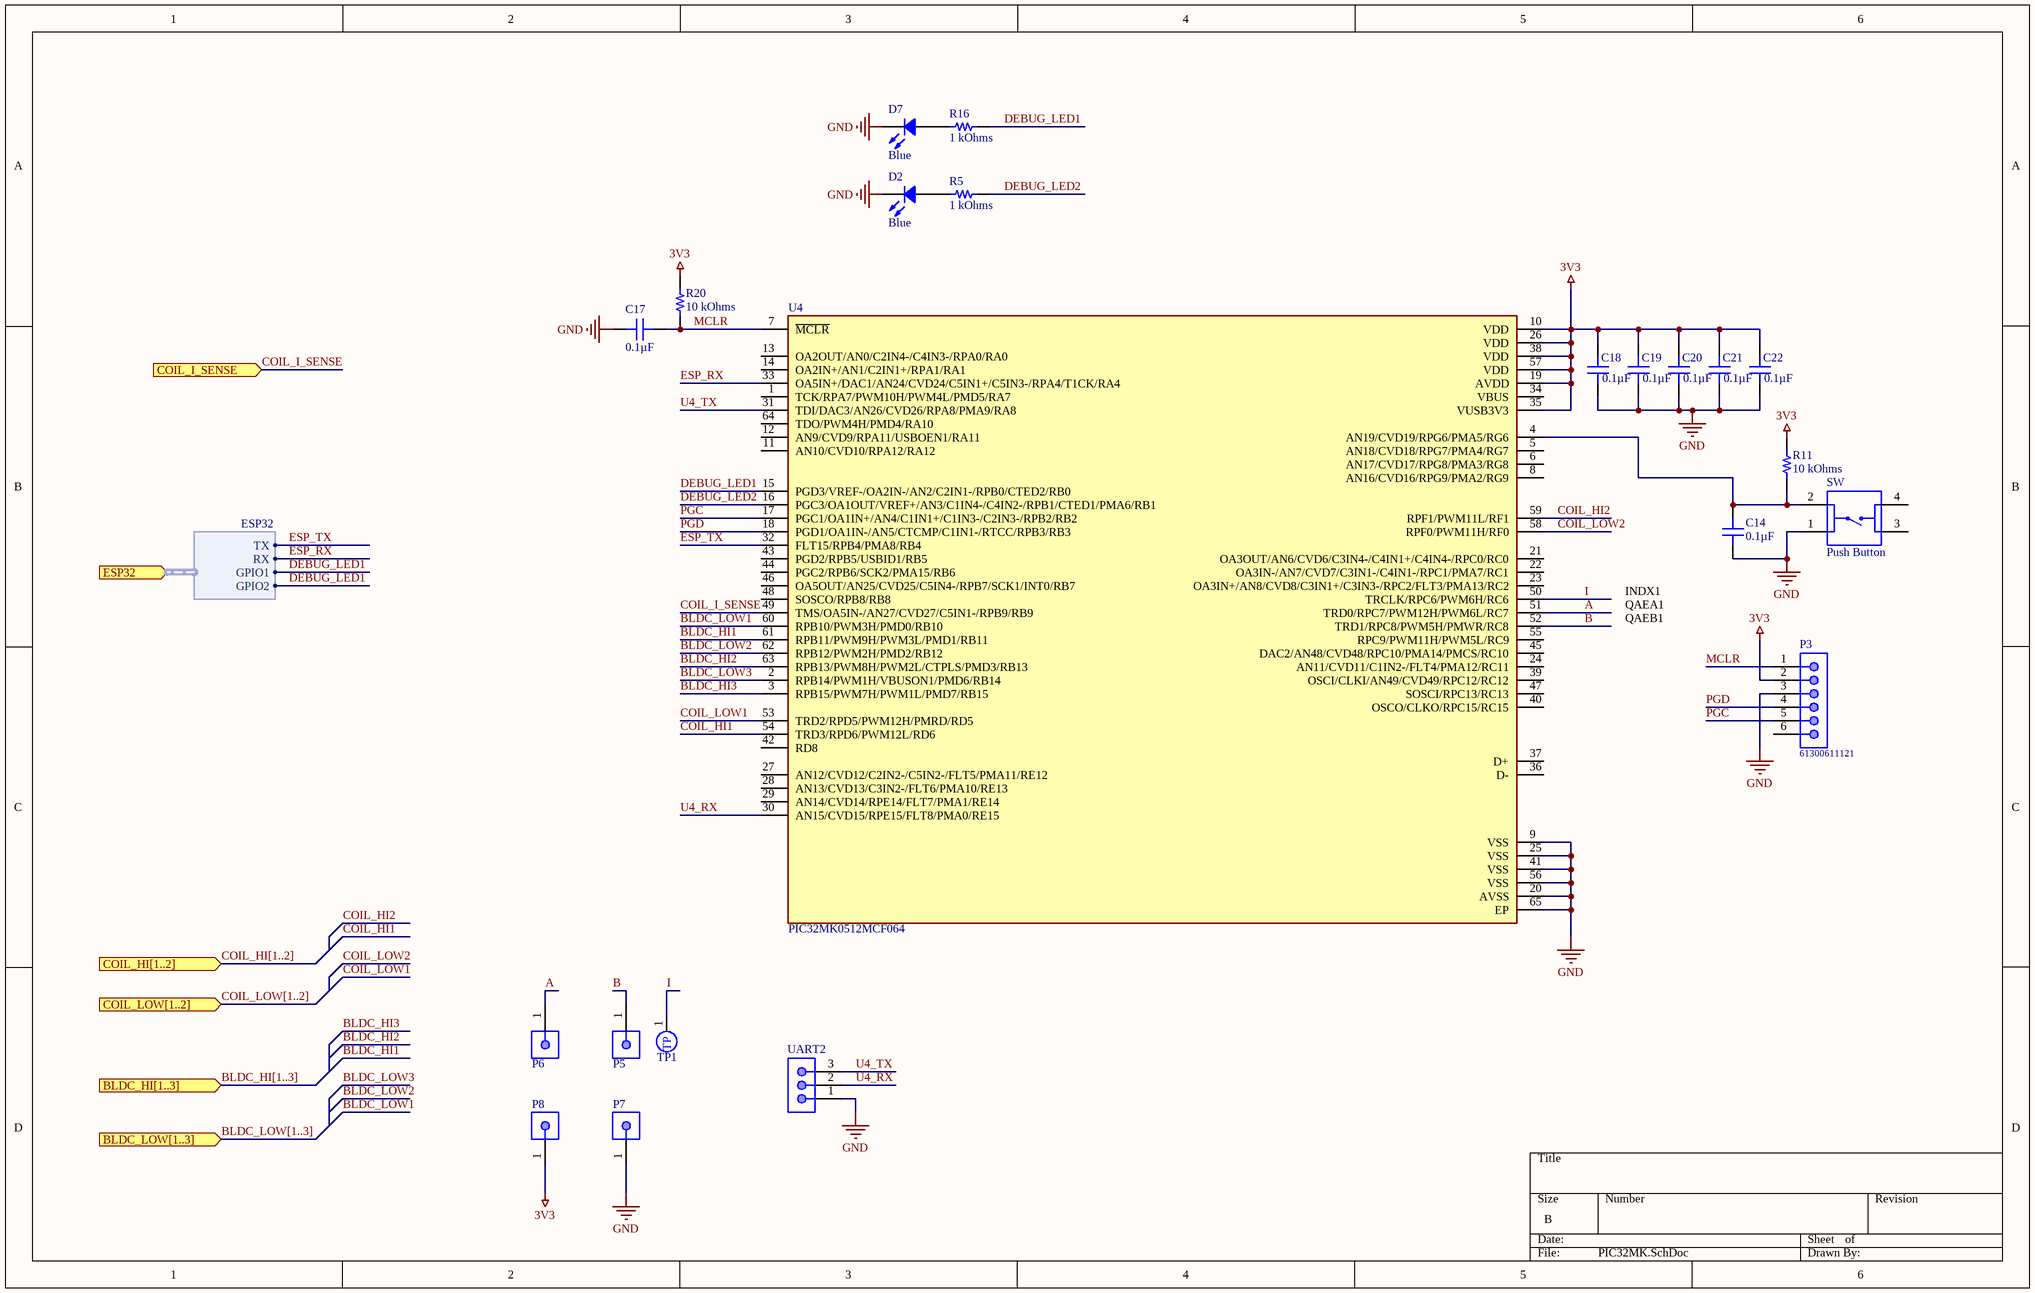
[diagram p2: PIC32MK.SchDoc]

### Parts
C14  0.1µF  [CAP 0603_1608]
C17  0.1µF  [CAP 0603_1608]
C18  0.1µF  [CAP 0603_1608]
C19  0.1µF  [CAP 0603_1608]
C20  0.1µF  [CAP 0603_1608]
C21  0.1µF  [CAP 0603_1608]
C22  0.1µF  [CAP 0603_1608]
D2  Blue  [LED 0603_1608 GREEN]
D7  Blue  [LED 0603_1608 GREEN]
P3  61300611121  [61300611121]
P5  61300111121  [61300111121]  (value not drawn)
P6  61300111121  [61300111121]  (value not drawn)
P7  61300111121  [61300111121]  (value not drawn)
P8  61300111121  [61300111121]  (value not drawn)
R5  1 kOhms  [RES 0603_1608]
R11  10 kOhms  [RES 0603_1608]
R16  1 kOhms  [RES 0603_1608]
R20  10 kOhms  [RES 0603_1608]
SW  Push Button  [PushButton]
TP1  TP  [TP]  (value not drawn)
U4  PIC32MK0512MCF064  [QFN50P900X900X100-65N]
UART2  3 pin 2mm JST Male  [3pin - 2mm header]  (value not drawn)

### Ports
BLDC_HI[1..3] (in), BLDC_LOW[1..3] (in), COIL_HI[1..2] (in), COIL_I_SENSE (in), COIL_LOW[1..2] (in), ESP32 (in, harness ESP32)

### Harnesses
ESP32: TX, RX, GPIO1, GPIO2

### Nets
3V3: C18.1 C19.1 C20.1 C21.1 C22.1 P3.2 P8.1 R11.2 R20.2 U4.10(VDD) U4.19(AVDD) U4.26(VDD) U4.35(VUSB3V3) U4.38(VDD) U4.57(VDD)
GND: C14.2 C17.2 C18.2 C19.2 C20.2 C21.2 C22.2 D2.2 D7.2 P3.3 P7.1 SW.1 U4.9(VSS) U4.20(AVSS) U4.25(VSS) U4.41(VSS) U4.56(VSS) U4.65(EP) UART2.1
A: P6.1 U4.51(TRD0/RPC7/PWM12H/PWM6L/RC7)
B: P5.1 U4.52(TRD1/RPC8/PWM5H/PMWR/RC8)
BLDC_HI1: U4.61(RPB11/PWM9H/PWM3L/PMD1/RB11)
BLDC_HI2: U4.63(RPB13/PWM8H/PWM2L/CTPLS/PMD3/RB13)
BLDC_HI3: U4.3(RPB15/PWM7H/PWM1L/PMD7/RB15)
BLDC_LOW1: U4.60(RPB10/PWM3H/PMD0/RB10)
BLDC_LOW2: U4.62(RPB12/PWM2H/PMD2/RB12)
BLDC_LOW3: U4.2(RPB14/PWM1H/VBUSON1/PMD6/RB14)
COIL_HI1: U4.54(TRD3/RPD6/PWM12L/RD6)
COIL_HI2: U4.59(RPF1/PWM11L/RF1)
COIL_I_SENSE: U4.49(TMS/OA5IN-/AN27/CVD27/C5IN1-/RPB9/RB9) ; port COIL_I_SENSE
COIL_LOW1: U4.53(TRD2/RPD5/PWM12H/PMRD/RD5)
COIL_LOW2: U4.58(RPF0/PWM11H/RF0)
DEBUG_LED1: R16.1 U4.15(PGD3/VREF-/OA2IN-/AN2/C2IN1-/RPB0/CTED2/RB0) ; port ESP32.GPIO1, port ESP32.GPIO2
DEBUG_LED2: R5.1 U4.16(PGC3/OA1OUT/VREF+/AN3/C1IN4-/C4IN2-/RPB1/CTED1/PMA6/RB1)
ESP_RX: U4.33(OA5IN+/DAC1/AN24/CVD24/C5IN1+/C5IN3-/RPA4/T1CK/RA4) ; port ESP32.RX
ESP_TX: U4.32(FLT15/RPB4/PMA8/RB4) ; port ESP32.TX
I: TP1.1(TP) U4.50(TRCLK/RPC6/PWM6H/RC6)
MCLR: C17.1 P3.1 R20.1 U4.7(~{MCLR})
PGC: P3.5 U4.17(PGC1/OA1IN+/AN4/C1IN1+/C1IN3-/C2IN3-/RPB2/RB2)
PGD: P3.4 U4.18(PGD1/OA1IN-/AN5/CTCMP/C1IN1-/RTCC/RPB3/RB3)
U4_RX: U4.30(AN15/CVD15/RPE15/FLT8/PMA0/RE15) UART2.2
U4_TX: U4.31(TDI/DAC3/AN26/CVD26/RPA8/PMA9/RA8) UART2.3
NetC14_1: C14.1 R11.1 SW.2 U4.4(AN19/CVD19/RPG6/PMA5/RG6)
NetD2_1: D2.1 R5.2
NetD7_1: D7.1 R16.2

Not connected (* = marked no-connect by the designer): P3 6; SW 3 4; U4 1(TCK/RPA7/PWM10H/PWM4L/PMD5/RA7) 5(AN18/CVD18/RPG7/PMA4/RG7) 6(AN17/CVD17/RPG8/PMA3/RG8) 8(AN16/CVD16/RPG9/PMA2/RG9) 11(AN10/CVD10/RPA12/RA12) 12(AN9/CVD9/RPA11/USBOEN1/RA11) 13(OA2OUT/AN0/C2IN4-/C4IN3-/RPA0/RA0) 14(OA2IN+/AN1/C2IN1+/RPA1/RA1) 21(OA3OUT/AN6/CVD6/C3IN4-/C4IN1+/C4IN4-/RPC0/RC0) 22(OA3IN-/AN7/CVD7/C3IN1-/C4IN1-/RPC1/PMA7/RC1) 23(OA3IN+/AN8/CVD8/C3IN1+/C3IN3-/RPC2/FLT3/PMA13/RC2) 24(AN11/CVD11/C1IN2-/FLT4/PMA12/RC11) 27(AN12/CVD12/C2IN2-/C5IN2-/FLT5/PMA11/RE12) 28(AN13/CVD13/C3IN2-/FLT6/PMA10/RE13) 29(AN14/CVD14/RPE14/FLT7/PMA1/RE14) 34(VBUS) 36(D-) 37(D+) 39(OSCI/CLKI/AN49/CVD49/RPC12/RC12) 40(OSCO/CLKO/RPC15/RC15) 42(RD8) 43(PGD2/RPB5/USBID1/RB5) 44(PGC2/RPB6/SCK2/PMA15/RB6) 45(DAC2/AN48/CVD48/RPC10/PMA14/PMCS/RC10) 46(OA5OUT/AN25/CVD25/C5IN4-/RPB7/SCK1/INT0/RB7) 47(SOSCI/RPC13/RC13) 48(SOSCO/RPB8/RB8) 55(RPC9/PWM11H/PWM5L/RC9) 64(TDO/PWM4H/PMD4/RA10)

### Buses and harness runs
bus BLDC_HI[1..3] = port BLDC_HI[1..3]
bus BLDC_LOW[1..3] = port BLDC_LOW[1..3]
bus COIL_HI[1..2] = port COIL_HI[1..2]
bus COIL_LOW[1..2] = port COIL_LOW[1..2]

### Notes on the sheet
- QAEB1
- QAEA1
- INDX1

### Library data of the parts
C14 C17-C22 = GCG188R92A104KA03D: as C7 on sheet Top; Part Number: GCG188R92A104KA03D; Value: 0.1µF; Applications: Automotive; Capacitance: 0.1µF; ComponentLink1Description: Datasheet; ComponentLink1URL: https://search.murata.co.jp/Ceramy/image/img/A01X/G101/ENG/GCG188R92A104KA03-01.pdf; ComponentLink2Description: DigiKey Link; ComponentLink2URL: http://digikey.com/product-detail/en/murata-electronics/GCG188R92A104KA03D/490-18197-1-ND/9867926; Device Package: 0603 (1608 Metric); Features: Epoxy Mountable; LastUpdated: 21-Jan-20 12:01:59 AM; Lifecycle Status: Active; Minimum Order: 1; Mounting Type: Surface Mount, MLCC, Epoxy; Operating Temperature: -55°C ~ 150°C; Package / Case: 0603 (1608 Metric); Packaging: TapeAndReel; PartId: 9025; Part Status: Active; Price: 0.07; Ratings: AEC-Q200; Series: GCG; Size / Dimension: 0.063" L x 0.031" W (1.60mm x 0.80mm); Supplier 1: DigiKey; Supplier Part Number 1: 490-18197-1-ND; Thickness (Max): 0.035" (0.90mm); Voltage - Rated: 100V
D2 D7 = XZCDGK53W-8VF: Blue LED; Manufacturer: SunLED; Color: Green; Configuration: Independent; Current - Test: 2mA; Lens Color: Colorless; Lens Size: 0.35mm Dia; Lens Style: Round with Domed Top; Lens Transparency: Clear; Millicandela Rating: 417mcd; Value: Green; Viewing Angle: 60°; Voltage - Forward (Vf) (Typ): 2.65V; Wavelength - Dominant: 525nm; Wavelength - Peak: 515nm; Part Number: XZCDGK53W-8VF; ComponentLink1Description: Datasheet; ComponentLink1URL: https://www.sunledusa.com/products/spec/XZCDGK53W-8VF.pdf; ComponentLink2Description: DigiKey Link; ComponentLink2URL: http://digikey.com/product-detail/en/sunled/XZCDGK53W-8VF/1497-XZCDGK53W-8VFCT-ND/10449792; Device Package: 0603 (1608 Metric); Height (Max): 1.10mm; LastUpdated: 21-Jan-20 3:12:09 AM; Lifecycle Status: Active; Minimum Order: 1; Mounting Type: Surface Mount; Package / Case: 0603 (1608 Metric); Packaging: Unknown; PartId: 938; Part Status: Active; Price: 0.18; Series: Ultra Low Current; Size / Dimension: 1.60mm L x 0.80mm W; Supplier 1: DigiKey; Supplier Part Number 1: 1497-XZCDGK53W-8VFCT-ND; Supplier Device Package: 2-SMD
P3 = 61300611121: WR-PHD Pin Header, THT, pitch 2.54mm, Single Row, Vertical, 6p; Manufacturer: Wurth Elektronik; Pin Number: 6; Rated Current: 3A; Working Voltage: 250VAC; Withstanding Voltage: 500VAC; Contact Resistance: 20mOhm; ComponentLink1Description: Manufacturer; ComponentLink1URL: http://www.we-online.de; ComponentLink2Description: Datasheet; ComponentLink2URL: https://www.we-online.com/catalog/datasheet/61300611121.pdf; Manufacturer Part Number: 61300611121; Published Date: May 2020; Pitch: 2.54mm; Operating Temperature: -40 to +105degC; Mounting Technology: THT; Packaging: Bag; Gender: Pin Header; Row Number: Single; Orientation: Vertical
P5-P8 = 61300111121: WR-PHD Pin Header, THT, pitch 2.54mm, Single Row, Vertical, 1p; Manufacturer: Wurth Elektronik; Pin Number: 1; Rated Current: 3A; Working Voltage: 250VAC; Withstanding Voltage: 500VAC; Contact Resistance: 20mOhm; ComponentLink1Description: Manufacturer; ComponentLink1URL: http://www.we-online.de; ComponentLink2Description: Datasheet; ComponentLink2URL: https://www.we-online.com/catalog/datasheet/61300111121.pdf; Manufacturer Part Number: 61300111121; Published Date: May 2020; Pitch: 2.54mm; Operating Temperature: -40 to +105degC; Mounting Technology: THT; Packaging: Bag; Gender: Pin Header; Row Number: Single; Orientation: Vertical
R5 R16 = RNCF0603DTE1K00: as R1 on sheet Top; Part Number: RNCF0603DTE1K00; Value: 1 kOhms; ComponentLink1Description: Datasheet; ComponentLink1URL: https://www.seielect.com/catalog/sei-rncf.pdf; ComponentLink2Description: DigiKey Link; ComponentLink2URL: http://digikey.com/product-detail/en/stackpole-electronics-inc/RNCF0603DTE1K00/RNCF0603DTE1K00CT-ND/9915086; Composition: Thin Film; Device Package: 0603 (1608 Metric); Features: Automotive AEC-Q200; Height - Seated (Max): 0.022" (0.55mm); LastUpdated: 21-Jan-20 12:14:28 AM; Lifecycle Status: Active; Minimum Order: 1; Number of Terminations: 2; Operating Temperature: -55°C ~ 155°C; Package / Case: 0603 (1608 Metric); Packaging: TapeAndReel; PartId: 26300; Part Status: Active; Price: 0.05; Ratings: AEC-Q200; Resistance: 1 kOhms; Series: RNCF; Size / Dimension: 0.061" L x 0.031" W (1.55mm x 0.80mm); Supplier 1: DigiKey; Supplier Part Number 1: RNCF0603DTE1K00CT-ND; Supplier Device Package: 0603; Tolerance: ±0.5%
R11 R20 = RNCS0603BKE10K0: as R3 on sheet Top; Part Number: RNCS0603BKE10K0; Value: 10 kOhms; ComponentLink1Description: Datasheet; ComponentLink1URL: https://www.seielect.com/catalog/sei-rncs_rnch.pdf; ComponentLink2Description: DigiKey Link; ComponentLink2URL: http://digikey.com/product-detail/en/stackpole-electronics-inc/RNCS0603BKE10K0/RNCS0603BKE10K0CT-ND/1800113; Composition: Thin Film; Device Package: 0603 (1608 Metric); Features: Anti-Corrosive, Automotive AEC-Q200, Moisture Resistant; Height - Seated (Max): 0.022" (0.55mm); LastUpdated: 21-Jan-20 12:25:01 AM; Lifecycle Status: Active; Minimum Order: 1; Number of Terminations: 2; Operating Temperature: -55°C ~ 155°C; Package / Case: 0603 (1608 Metric); Packaging: TapeAndReel; PartId: 4838; Part Status: Active; Price: 0.08; Ratings: AEC-Q200; Resistance: 10 kOhms; Series: RNCS; Size / Dimension: 0.061" L x 0.031" W (1.55mm x 0.80mm); Supplier 1: DigiKey; Supplier Part Number 1: RNCS0603BKE10K0CT-ND; Supplier Device Package: 0603; Tolerance: ±0.1%
SW = Push Button: 50 mA SPST Round Actuator 160 Gram Force Tactile Pushbutton Switch; MP: 1825910-2; Contact_Current_Rating: 50 mA; MF: TE Connectivity; Configuration_Pole-Throw: Single Pole - Single Throw; Availability: Unavailable; Value: *; Package: None; SnapEDA_Link: https://www.snapeda.com/parts/1825910-2/TE%20Connectivity%20ALCOSWITCH%20Switches/view-part/278983/?ref=snap; TE_purchase_URL: https://www.te.com/usa-en/product-1825910-2.html?te_bu=Cor&te_type=disp&te_campaign=seda_glo_cor-seda-global-disp-prtnr-fy19-seda-model-bom-cta_sma-317_1&elqCampaignId=32493; EU_RoHS_Compliance: Compliant; Price: None
TP1 = TP: Test point
U4 = PIC32MK0512MCF064: PIC32MK Microcontroller IC 32-Bit 120MHz 1MB _1M x 8_ FLASH 64-TQFP _10x10_; MP: PIC32MK1024MCF064-I/PT; MF: Microchip; Digi-Key_Purchase_URL: https://www.digikey.kr/product-detail/en/microchip-technology/PIC32MK1024MCF064-I-PT/PIC32MK1024MCF064-I-PT-ND/7164902?utm_source=snapeda&utm_medium=aggregator&utm_campaign=symbol; Package: TQFP-64 Microchip; Digi-Key_Part_Number: PIC32MK1024MCF064-I/PT-ND; Value: *; SnapEDA_Link: https://www.snapeda.com/parts/PIC32MK1024MCF064-I/PT/Microchip/view-part/876704/?ref=snap

## Sheet ESP32.SchDoc
size A
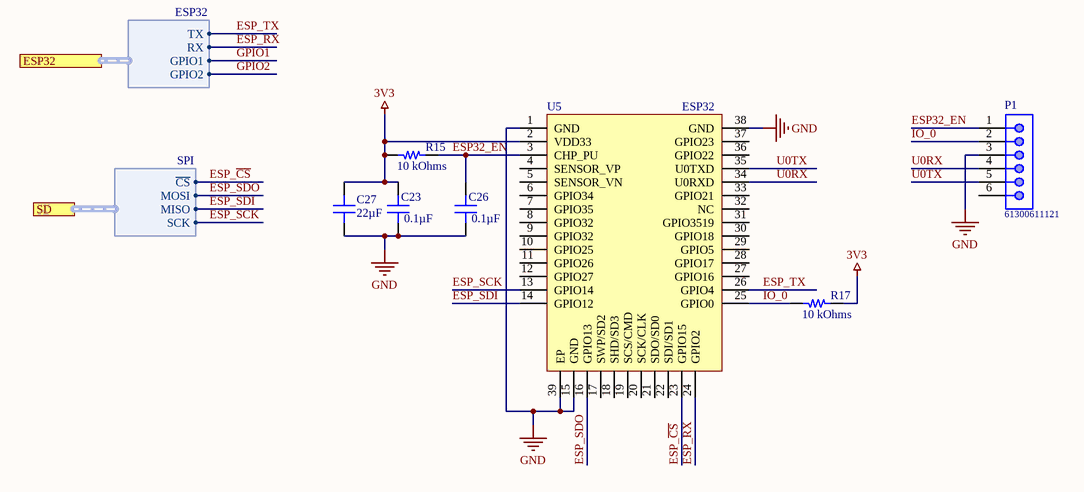
[diagram p3: ESP32.SchDoc]

### Parts
C23  0.1µF  [CAP 0603_1608]
C26  0.1µF  [CAP 0603_1608]
C27  22µF  [CAP 0805_2012]
P1  61300611121  [61300611121]
R15  10 kOhms  [RES 0603_1608]
R17  10 kOhms  [RES 0603_1608]
U5  ESP32  [Espressif ESP32-WROOM-32]

### Ports
ESP32 (harness ESP32), SD (harness SPI)

### Harnesses
SPI: ~{CS}, MOSI, MISO, SCK
ESP32: TX, RX, GPIO1, GPIO2

### Nets
3V3: C23.1 C27.2 R15.2 R17.1 U5.2(VDD33)
GND: C23.2 C26.2 C27.1 P1.3 U5.1(GND) U5.15(GND) U5.38(GND) U5.39(EP)
ESP32_EN: C26.1 P1.1 R15.1 U5.3(CHP_PU)
ESP_~{CS}: U5.23(GPIO15) ; port SD.~{CS}
ESP_RX: U5.24(GPIO2) ; port ESP32.RX
ESP_SCK: U5.13(GPIO14) ; port SD.SCK
ESP_SDI: U5.14(GPIO12) ; port SD.MISO
ESP_SDO: U5.16(GPIO13) ; port SD.MOSI
ESP_TX: U5.26(GPIO4) ; port ESP32.TX
GPIO1: port ESP32.GPIO1, port ESP32.GPIO2  [also labelled GPIO2]  [project net DEBUG_LED1]
IO_0: P1.2 R17.2 U5.25(GPIO0)
U0RX: P1.4 U5.34(U0RXD)
U0TX: P1.5 U5.35(U0TXD)

Not connected (* = marked no-connect by the designer): P1 6; U5 4(SENSOR_VP) 5(SENSOR_VN) 6(GPIO34) 7(GPIO35) 8(GPIO32) 9(GPIO32) 10(GPIO25) 11(GPIO26) 12(GPIO27) 17(SWP/SD2) 18(SHD/SD3) 19(SCS/CMD) 20(SCK/CLK) 21(SDO/SD0) 22(SDI/SD1) 27(GPIO16) 28(GPIO17) 29(GPIO5) 30(GPIO18) 31(GPIO3519) 32(NC) 33(GPIO21) 36(GPIO22) 37(GPIO23)

### Library data of the parts
C23 C26 = GCG188R92A104KA03D: as C7 on sheet Top; Part Number: GCG188R92A104KA03D; Value: 0.1µF; Applications: Automotive; Capacitance: 0.1µF; ComponentLink1Description: Datasheet; ComponentLink1URL: https://search.murata.co.jp/Ceramy/image/img/A01X/G101/ENG/GCG188R92A104KA03-01.pdf; ComponentLink2Description: DigiKey Link; ComponentLink2URL: http://digikey.com/product-detail/en/murata-electronics/GCG188R92A104KA03D/490-18197-1-ND/9867926; Device Package: 0603 (1608 Metric); Features: Epoxy Mountable; LastUpdated: 21-Jan-20 12:01:59 AM; Lifecycle Status: Active; Minimum Order: 1; Mounting Type: Surface Mount, MLCC, Epoxy; Operating Temperature: -55°C ~ 150°C; Package / Case: 0603 (1608 Metric); Packaging: TapeAndReel; PartId: 9025; Part Status: Active; Price: 0.07; Ratings: AEC-Q200; Series: GCG; Size / Dimension: 0.063" L x 0.031" W (1.60mm x 0.80mm); Supplier 1: DigiKey; Supplier Part Number 1: 490-18197-1-ND; Thickness (Max): 0.035" (0.90mm); Voltage - Rated: 100V
C27 = CL21A226MOQNNNE: as C4 on sheet Top; Part Number: CL21A226MOQNNNE; Value: 22µF; Applications: General Purpose; Capacitance: 22µF; ComponentLink1Description: Datasheet; ComponentLink1URL: http://www.samsungsem.com/kr/support/product-search/mlcc/CL21A226MOQNNNE.jsp; ComponentLink2Description: DigiKey Link; ComponentLink2URL: http://digikey.com/product-detail/en/samsung-electro-mechanics/CL21A226MOQNNNE/1276-2909-1-ND/3890995; Device Package: 0805 (2012 Metric); LastUpdated: 21-Jan-20 12:03:05 AM; Lifecycle Status: Active; Minimum Order: 1; Mounting Type: Surface Mount, MLCC; Operating Temperature: -55°C ~ 85°C; Package / Case: 0805 (2012 Metric); Packaging: TapeAndReel; PartId: 3052; Part Status: Active; Price: 0.11; Series: CL; Size / Dimension: 0.079" L x 0.049" W (2.00mm x 1.25mm); Supplier 1: DigiKey; Supplier Part Number 1: 1276-2909-1-ND; Temperature Coefficient: X5R; Thickness (Max): 0.055" (1.40mm); Voltage - Rated: 16V
P1 = 61300611121: as P3 on sheet PIC32MK; ComponentLink1Description: Manufacturer; ComponentLink1URL: http://www.we-online.de; ComponentLink2Description: Datasheet; ComponentLink2URL: https://www.we-online.com/catalog/datasheet/61300611121.pdf; Manufacturer Part Number: 61300611121; Published Date: May 2020; Pitch: 2.54mm; Operating Temperature: -40 to +105degC; Mounting Technology: THT; Packaging: Bag; Gender: Pin Header; Row Number: Single; Orientation: Vertical
R15 R17 = RNCS0603BKE10K0: as R3 on sheet Top; Part Number: RNCS0603BKE10K0; Value: 10 kOhms; ComponentLink1Description: Datasheet; ComponentLink1URL: https://www.seielect.com/catalog/sei-rncs_rnch.pdf; ComponentLink2Description: DigiKey Link; ComponentLink2URL: http://digikey.com/product-detail/en/stackpole-electronics-inc/RNCS0603BKE10K0/RNCS0603BKE10K0CT-ND/1800113; Composition: Thin Film; Device Package: 0603 (1608 Metric); Features: Anti-Corrosive, Automotive AEC-Q200, Moisture Resistant; Height - Seated (Max): 0.022" (0.55mm); LastUpdated: 21-Jan-20 12:25:01 AM; Lifecycle Status: Active; Minimum Order: 1; Number of Terminations: 2; Operating Temperature: -55°C ~ 155°C; Package / Case: 0603 (1608 Metric); Packaging: TapeAndReel; PartId: 4838; Part Status: Active; Price: 0.08; Ratings: AEC-Q200; Resistance: 10 kOhms; Series: RNCS; Size / Dimension: 0.061" L x 0.031" W (1.55mm x 0.80mm); Supplier 1: DigiKey; Supplier Part Number 1: RNCS0603BKE10K0CT-ND; Supplier Device Package: 0603; Tolerance: ±0.1%

## Nets that join several sheets
3V3: Top (13 pins), PIC32MK (15 pins), ESP32 (5 pins)
GND: Top (23 pins), U_BLDC1 (7 pins), U_BLDC2 (7 pins), U_BLDC3 (7 pins), PIC32MK (19 pins), U_COIL1 (7 pins), U_COIL2 (7 pins), ESP32 (8 pins)
VBAT: Top (10 pins), U_BLDC1 (7 pins), U_BLDC2 (7 pins), U_BLDC3 (7 pins), U_COIL1 (7 pins), U_COIL2 (7 pins)
BLDC_HI1: U_BLDC1 (U2_1.7), PIC32MK (U4.61)
BLDC_HI2: U_BLDC2 (U2_2.7), PIC32MK (U4.63)
BLDC_HI3: U_BLDC3 (U2_3.7), PIC32MK (U4.3)
BLDC_LOW1: U_BLDC1 (U2_1.8), PIC32MK (U4.60)
BLDC_LOW2: U_BLDC2 (U2_2.8), PIC32MK (U4.62)
BLDC_LOW3: U_BLDC3 (U2_3.8), PIC32MK (U4.2)
BRIDGE_OUT: Top (R10.1 U3.4), U_COIL1 (10 pins)
COIL_HI1: PIC32MK (U4.54), U_COIL1 (U2_4.7)
COIL_HI2: PIC32MK (U4.59), U_COIL2 (U2_5.7)
COIL_I_SENSE: Top (U3.6), PIC32MK (U4.49)
COIL_LOW1: PIC32MK (U4.53), U_COIL1 (U2_4.8)
COIL_LOW2: PIC32MK (U4.58), U_COIL2 (U2_5.8)
ESP_~{CS}: Top (J4.2), ESP32 (U5.23)
ESP_RX: PIC32MK (U4.33), ESP32 (U5.24)
ESP_SCK: Top (J4.5), ESP32 (U5.13)
ESP_SDI: Top (J4.7), ESP32 (U5.14)
ESP_SDO: Top (J4.3), ESP32 (U5.16)
ESP_TX: PIC32MK (U4.32), ESP32 (U5.26)

## Assembly variants
Main: all parts fitted